# EAGLE design AH3761 (EAGLE 9.0.1)
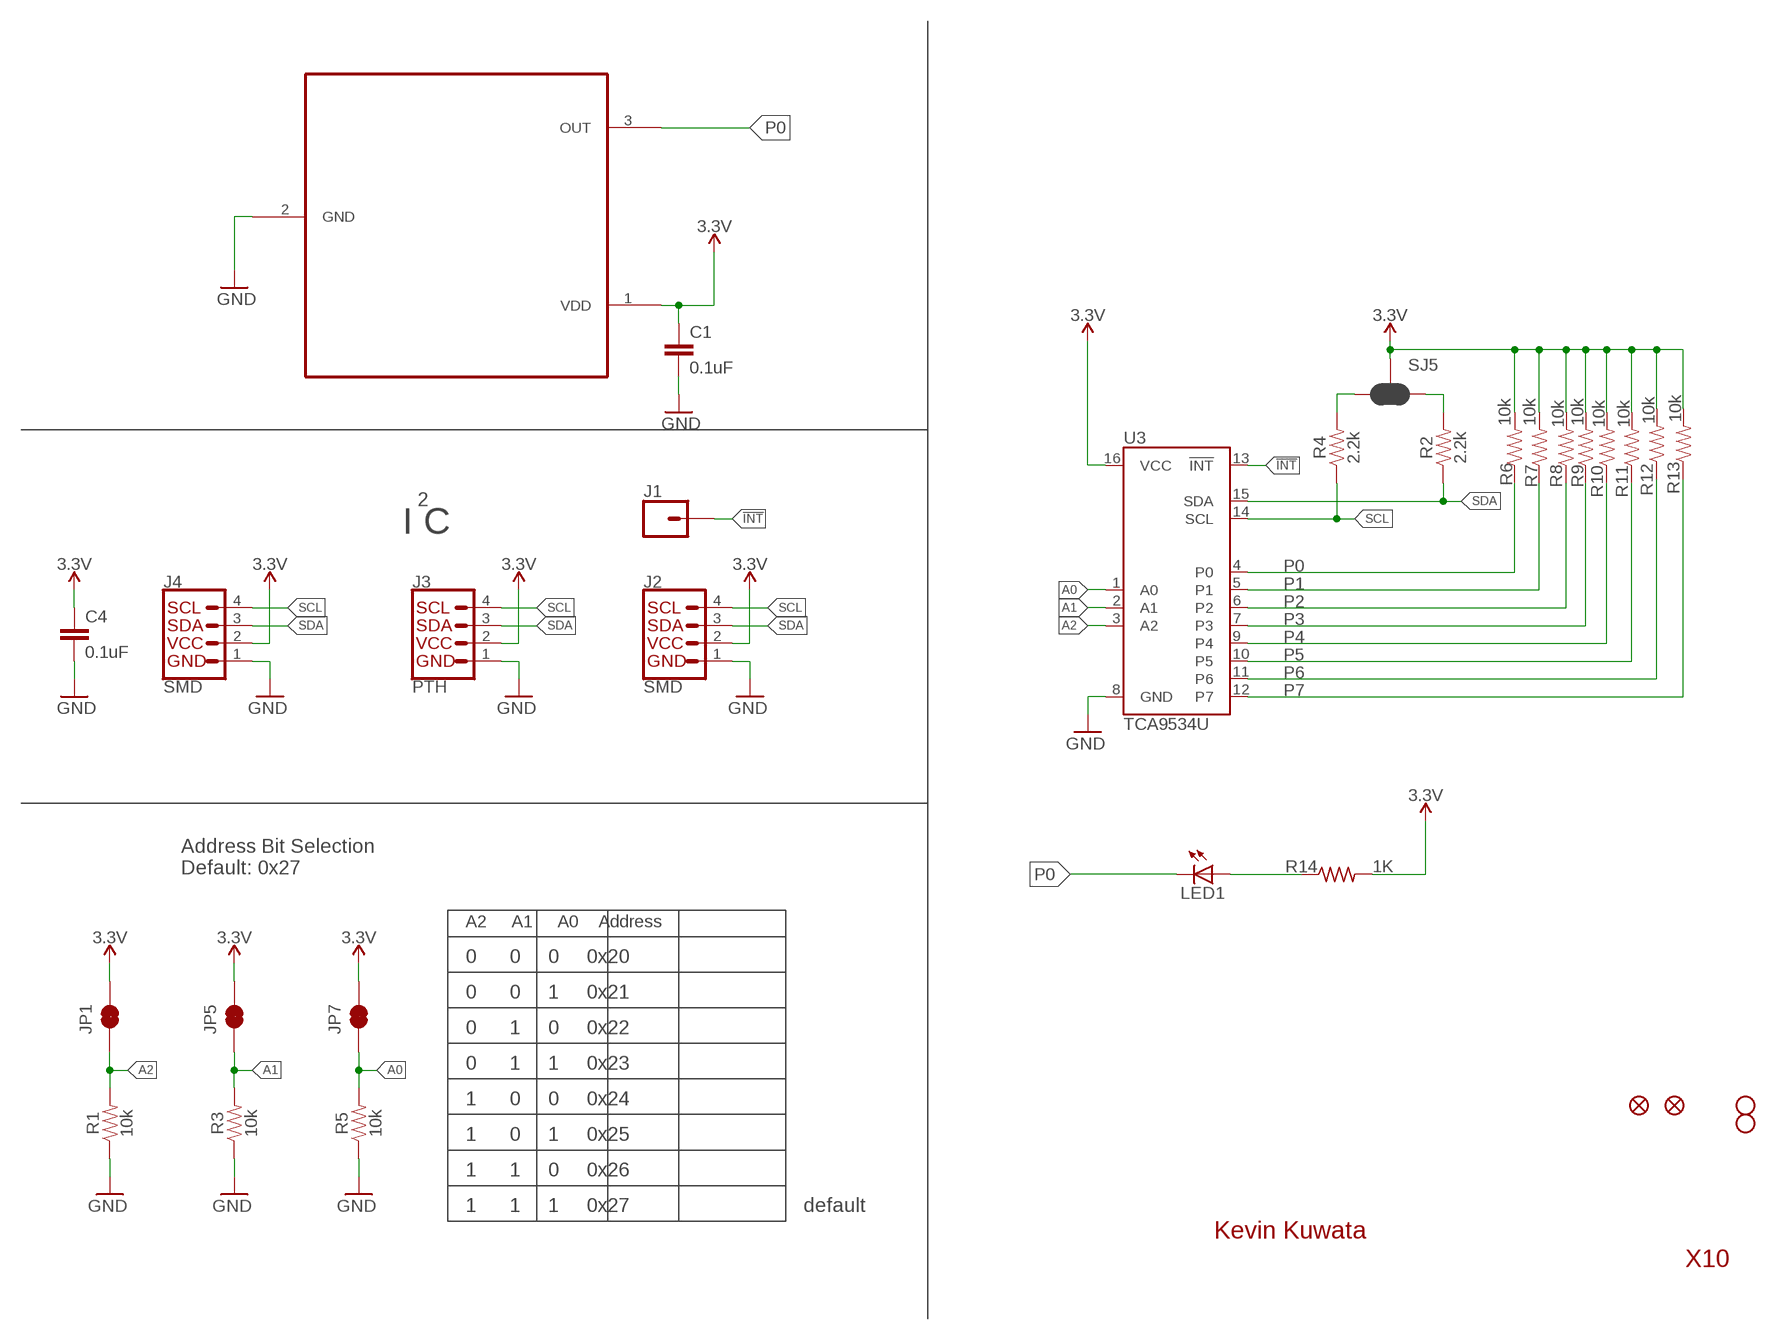
[diagram p0: schematic, sheet 1]

## Parts
C1  0.1uF  0.1UF-0603-25V-(+80/-20%)  [0603]
C4  0.1uF  0.1UF-0603-25V-(+80/-20%)  [0603]
J1  CONN_01PTH_NO_SILK_YES_STOP  [1X01_NO_SILK]
J2  SMD  I2C_STANDARDJS-1MM  [1X04_1MM_RA]
J3  PTH  I2C_STANDARD_NO_SILK  [1X04_NO_SILK]
J4  SMD  I2C_STANDARDJS-1MM  [1X04_1MM_RA]
JP1  JUMPER-SMT_2_NC_TRACE_NO-SILK  [SMT-JUMPER_2_NC_TRACE_NO-SILK]
JP2  FIDUCIALUFIDUCIAL  [MICRO-FIDUCIAL]
JP3  STAND-OFF  [STAND-OFF]
JP4  STAND-OFF  [STAND-OFF]
JP5  JUMPER-SMT_2_NC_TRACE_NO-SILK  [SMT-JUMPER_2_NC_TRACE_NO-SILK]
JP6  FIDUCIALUFIDUCIAL  [MICRO-FIDUCIAL]
JP7  JUMPER-SMT_2_NC_TRACE_NO-SILK  [SMT-JUMPER_2_NC_TRACE_NO-SILK]
LED1  LEDCHIPLED_0603  [CHIPLED_0603]
R1  10k  2.2KOHM-0603-1/10W-1%  [0603]
R2  2.2k  2.2KOHM-0603-1/10W-1%  [0603]
R3  10k  2.2KOHM-0603-1/10W-1%  [0603]
R4  2.2k  2.2KOHM-0603-1/10W-1%  [0603]
R5  10k  2.2KOHM-0603-1/10W-1%  [0603]
R6  10k  10KOHM-0603-1/10W-1%  [0603]
R7  10k  10KOHM-0603-1/10W-1%  [0603]
R8  10k  10KOHM-0603-1/10W-1%  [0603]
R9  10k  10KOHM-0603-1/10W-1%  [0603]
R10  10k  10KOHM-0603-1/10W-1%  [0603]
R11  10k  10KOHM-0603-1/10W-1%  [0603]
R12  10k  10KOHM-0603-1/10W-1%  [0603]
R13  10k  10KOHM-0603-1/10W-1%  [0603]
R14  1K  R-US_R0603  [R0603]
SJ5  SMT-JUMPER-_3-2-NC-PASTE_TALL  [SMT-JUMPER_3-2-NC-PASTE_SILK_TALLER_A]
U3  TCA9534U  [16SOIC]
U$1  AH3761  [SC-59]

## Nets
3.3V: C1.1 C4.1 J2.2(VCC) J3.2(VCC) J4.2(VCC) JP1.2 JP5.2 JP7.2 R6.2 R7.2 R8.2 R9.2 R10.2 R11.2 R12.2 R13.2 R14.2 SJ5.2 U3.16(VCC) U$1.1(VDD)
!INT: J1.1 U3.13(!INT)
A0: JP7.1 R5.2 U3.1(A0)
A1: JP5.1 R3.2 U3.2(A1)
A2: JP1.1 R1.2 U3.3(A2)
GND: C1.2 C4.2 J2.1(GND) J3.1(GND) J4.1(GND) R1.1 R3.1 R5.1 U3.8(GND) U$1.2(GND)
N$1: LED1.A R14.1
P0: LED1.C R6.1 U3.4(P0) U$1.3(OUT)
P1: R7.1 U3.5(P1)
P2: R8.1 U3.6(P2)
P3: R9.1 U3.7(P3)
P4: R10.1 U3.9(P4)
P5: R11.1 U3.10(P5)
P6: R12.1 U3.11(P6)
P7: R13.1 U3.12(P7)
SCL: J2.4(SCL) J3.4(SCL) J4.4(SCL) R4.1 U3.14(SCL)
SCL_PU1: R2.2 SJ5.1
SDA: J2.3(SDA) J3.3(SDA) J4.3(SDA) R2.1 U3.15(SDA)
SDA_PU1: R4.2 SJ5.3

## Notes on the sheet
- 2
- I C
- Address Bit Selection
  Default: 0x27
- A2     A1     A0    Address
- 0      0     0     0x20
- 0      0     1     0x21
- 0      1     0     0x22
- 0      1     1     0x23
- 1      0     0     0x24
- 1      0     1     0x25
- 1      1     0     0x26
- 1      1     1     0x27 | default
- Kevin Kuwata
- X10

## Library data of the parts
C1 C4 = SparkFun-Capacitors:0.1UF: 0.1µF ceramic capacitors A capacitor is a passive two-terminal electrical component used to store electrical energy temporarily in an electric field.; PROD_ID: CAP-00810
J1 = SparkFun-Connectors:CONN_01: Single connection point. Often used as Generic Header-pin footprint for 0.1 inch spaced/style header connections On any of the 0.1 inch spaced packages, you can populate with these: Break Away Headers - Straight <https://www.sparkfun.com/products/116> (PRT-00116) Break Away Male Headers - Right Angle <https://www.sparkfun.com/products/553> (PRT-00553) Female Headers <https://www.sparkfun.com/products/115> (PRT-00115) Break Away Headers - Machine Pin <https://www.sparkfun.com/products/117> (PRT-00117) Break Away Female Headers - Swiss Machine Pin <https://www.sparkfun.com/products/743> (PRT-00743) This device is also useful as a general connection point to wire up your design to another part of your project. Our various solder wires solder well into these plated through hole pads. Hook-Up Wire - Assortment (Stranded, 22 AWG) <https://www.sparkfun.com/products/11375> (PRT-11375) Hook-Up Wire - Assortment (Solid Core, 22 AWG) <https://www.sparkfun.com/products/11367> (PRT-11367) View the entire wire category on our website here <https://www.sparkfun.com/categories/141> Special notes: SMTSO-256-ET is a "flush mount" nut for a 4-40 screw. We mostly use this on specialty testbeds; it is a nice way to connect hardware to your PCB at an adjustable hieght. Also note, the SNAP packages are for using a snappable style connector. We sell a baggie of snaps and they are also used on two LilyPad designs: Snap Assortment - 30 pack (male and female) <https://www.sparkfun.com/products/11347> (DEV-11347) LilyPad Arduino SimpleSnap <https://www.sparkfun.com/products/10941> (DEV-10941) LilyPad SimpleSnap Protoboard <https://www.sparkfun.com/products/10940> (DEV-10940)
J2-J4 = SparkX:I2C_STANDARD: SparkFun I2C Standard Pinout Header SparkFun has standardized on a pinout for all I2C based sensor breakouts. This pinout allows I2C boards to be plugged directly into the headers on Arduino Uno compatible boards, and to be daisy chained easily. Example SparkFun Products: SparkFun Atmospheric Sensor Breakout - BME280 <https://www.sparkfun.com/products/13676> SparkFun Altitude/Pressure Sensor Breakout - MPL3115A2 <https://www.sparkfun.com/products/11084> SparkFun TOF Range Finder Sensor - VL6180 <https://www.sparkfun.com/products/12785>
JP1 JP5 JP7 = SparkFun-Jumpers:JUMPER-SMT_2_NC_TRACE: Normally closed trace jumper This jumper has a trace between two pads so it's normally closed (NC). Use a razor knife to open the connection. For best results follow the IPC guidelines for cutting traces: Cutout at least 0.063 mm (0.005 in). Remove all loose material to clean up the cut area. Seal the cut with an approved epoxy. Reapply solder to reclose the connection.
JP2 JP6 = SparkFun:FIDUCIAL: Fiducial Alignment Points Various fiducial points for machine vision alignment.
JP3 JP4 = SparkFun:STAND-OFF: Stand Off This is the mechanical footprint for a #4 phillips button head screw. Use the keepout ring to avoid running the screw head into surrounding components. SKU : PRT-00447
LED1 = adafruit:LED: LED OSRAM: - CHIPLED LG R971, LG N971, LY N971, LG Q971, LY Q971, LO R971, LY R971 LH N974, LH R974 LS Q976, LO Q976, LY Q976 LO Q996 - Hyper CHIPLED LW Q18S LB Q993, LB Q99A, LB R99A - SideLED LS A670, LO A670, LY A670, LG A670, LP A670 LB A673, LV A673, LT A673, LW A673 LH A674 LY A675 LS A676, LA A676, LO A676, LY A676, LW A676 LS A679, LY A679, LG A679 - Hyper Micro SIDELED® LS Y876, LA Y876, LO Y876, LY Y876 LT Y87S - SmartLED LW L88C, LW L88S LB L89C, LB L89S, LG L890 LS L89K, LO L89K, LY L89K LS L896, LA L896, LO L896, LY L896 - TOPLED LS T670, LO T670, LY T670, LG T670, LP T670 LSG T670, LSP T670, LSY T670, LOP T670, LYG T670 LG T671, LOG T671, LSG T671 LB T673, LV T673, LT T673, LW T673 LH T674 LS T676, LA T676, LO T676, LY T676, LB T676, LH T676, LSB T676, LW T676 LB T67C, LV T67C, LT T67C, LS T67K, LO T67K, LY T67K, LW E67C LS E67B, LA E67B, LO E67B, LY E67B, LB E67C, LV E67C, LT E67C LW T67C LS T679, LY T679, LG T679 LS T770, LO T770, LY T770, LG T770, LP T770 LB T773, LV T773, LT T773, LW T773 LH T774 LS E675, LA E675, LY E675, LS T675 LS T776, LA T776, LO T776, LY T776, LB T776 LHGB T686 LT T68C, LB T68C - Hyper Mini TOPLED® LB M676 - Mini TOPLED Santana® LG M470 LS M47K, LO M47K, LY M47K Source: http://www.osram.convergy.de/
R1 R3 R5 = SparkFun-Resistors:2.2KOHM: 2.2kΩ resistor A resistor is a passive two-terminal electrical component that implements electrical resistance as a circuit element. Resistors act to reduce current flow, and, at the same time, act to lower voltage levels within circuits. - Wikipedia; PROD_ID: RES-08272; VALUE: 2.2k
R2 R4 = SparkFun-Resistors:2.2KOHM: 2.2kΩ resistor A resistor is a passive two-terminal electrical component that implements electrical resistance as a circuit element. Resistors act to reduce current flow, and, at the same time, act to lower voltage levels within circuits. - Wikipedia; PROD_ID: RES-08272
R6-R13 = SparkFun-Resistors:10KOHM: 10kΩ resistor A resistor is a passive two-terminal electrical component that implements electrical resistance as a circuit element. Resistors act to reduce current flow, and, at the same time, act to lower voltage levels within circuits. - Wikipedia; PROD_ID: RES-00824
R14 = adafruit:R-US_: RESISTOR, American symbol
SJ5 = KevinKuwata_eagle:SMT-JUMPER-_3-2-NC-PASTE
U3 = KevinKuwata_eagle:TCA9534
U$1 = AH3761:AH3761

## Board
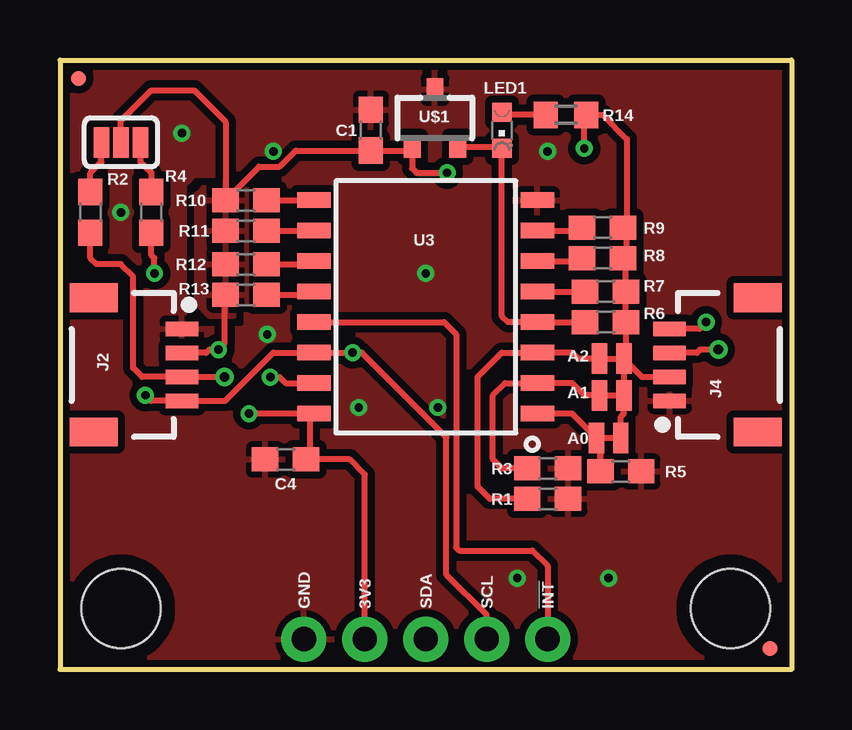
[diagram p1: board, top side]
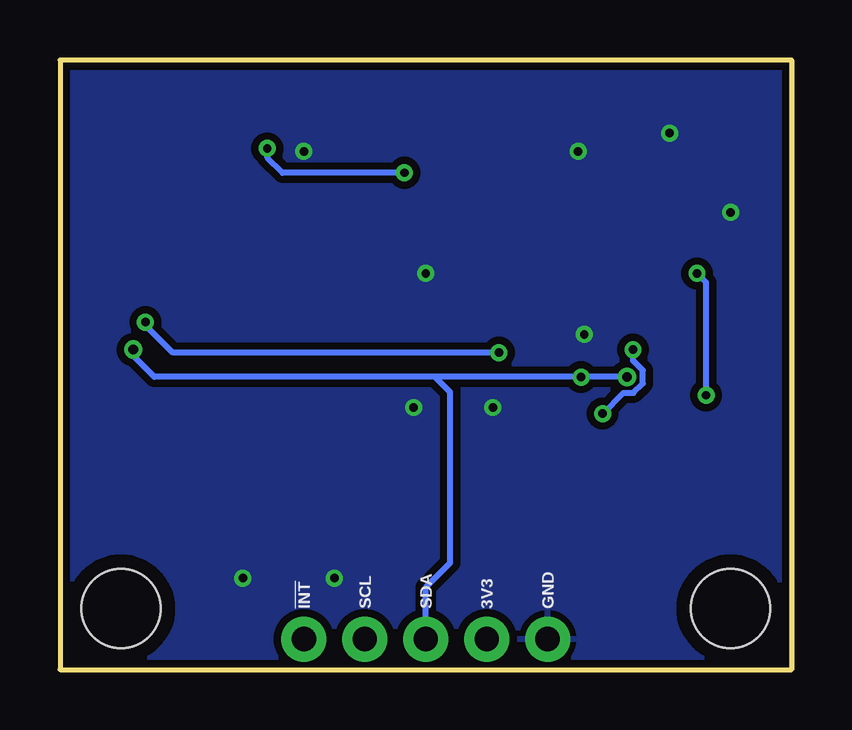
[diagram p2: board, bottom side, seen from below]

Size 30.48 x 25.4 mm. Coordinates in mm from the lower left corner, seen from the top.
Outline: 0,25.4 30.48,25.4 30.48,0 0,0 0,25.4
Copper layers (1*16): Top 0.035mm / dielectric 1.5mm / Bottom 0.035mm
Design rules "SparkFun-2-layer-PCBWay-LIMIT": minimum track width 6mil, minimum drill 12mil, track to track 6mil, track to pad 6mil, pad to pad 6mil, via to via 6mil, smd to smd 6mil, copper to edge 6mil, drill to drill 6mil, minimum pad ring 7mil, minimum via ring 7mil, stop-mask expansion 4mil, vias tented up to drill 25mil, thermal gap 10mil

### Footprints (pad centres in the part's own frame; a part is rotated, then mirrored left to right if it is on the bottom)
0603 = smd 1.1 x 1: 1 -0.85,0; 2 0.85,0
1X01_NO_SILK = drill 1.016 pad 1.88: 1 0,0
1X04_1MM_RA = smd 0.6 x 1.35: 1 -1.5,0; 2 -0.5,0; 3 0.5,0; 4 1.5,0 | smd 1.2 x 2: NC1 2.8,-3.675; NC2 -2.8,-3.675
1X04_NO_SILK = drill 1.016 pad 1.88: 1 0,0; 2 2.54,0; 3 5.08,0; 4 7.62,0
SMT-JUMPER_2_NC_TRACE_NO-SILK = smd 0.635 x 1.27: 1 -0.508,0; 2 0.508,0
MICRO-FIDUCIAL = smd 0.635 x 0.635: 1 0,0
STAND-OFF = hole 3.302: 0,0
CHIPLED_0603 = smd 0.8 x 0.8: A 0,-0.75; C 0,0.75
R0603 = smd 1 x 1.1: 1 -0.85,0; 2 0.85,0
SMT-JUMPER_3-2-NC-PASTE_SILK_TALLER_A = smd 0.635 x 1.27: 1 -0.813,0; 2 0,0; 3 0.813,0
16SOIC = smd 1.397 x 0.648: 1 -4.65,4.445; 2 -4.65,3.175; 3 -4.65,1.905; 4 -4.65,0.635; 5 -4.65,-0.635; 6 -4.65,-1.905; 7 -4.65,-3.175; 8 -4.65,-4.445; 9 4.65,-4.445; 10 4.65,-3.175; 11 4.65,-1.905; 12 4.65,-0.635; 13 4.65,0.635; 14 4.65,1.905; 15 4.65,3.175; 16 4.65,4.445
SC-59 = smd 0.7 x 0.9: 1 -0.95,-1.2; 2 0,1.2; 3 0.95,-1.2

### Placement (x,y rotation side)
C1  12.95,22.48 90 top
C4  9.4,8.76 180 top
J1  20.32,1.27 0 top
J2  5.08,12.7 270 top
J3  10.16,1.27 0 top
J4  25.4,12.7 90 top
JP1  22.99,12.95 0 top
JP2  29.59,0.89 0 top
JP3  2.54,2.54 0 top
JP4  27.94,2.54 0 top
JP5  22.99,11.43 0 top
JP6  0.76,24.64 0 top
JP7  22.86,9.65 0 top
LED1  18.41,22.48 180 top
R1  20.32,7.11 180 top
R2  1.27,19.05 90 top
R3  20.32,8.38 180 top
R4  3.81,19.05 90 top
R5  23.37,8.26 180 top
R6  22.73,14.48 0 top
R7  22.73,15.75 0 top
R8  22.61,17.14 0 top
R9  22.61,18.41 0 top
R10  7.75,19.56 180 top
R11  7.75,18.29 180 top
R12  7.75,16.89 180 top
R13  7.75,15.62 180 top
R14  21.08,23.11 0 top
SJ5  2.54,21.97 0 top
U3  15.24,15.11 180 top
U$1  15.62,22.99 0 top

### Tracks (layer width: path | path; a pad name or v marks a point on that pad's centre or on a via)
3.3V  (via drill 0.35)
  Top 0.254: JP7.2 23.37,10.54 23.5,10.67 JP5.2 23.5,12.55 | J3.2 12.7,8.13 12.06,8.76 10.41,8.76 | 10.41,8.76 C4.1 | 10.41,8.76 10.41,10.49 U3.16 v7.87,10.67 | J2.2 6.09,13.2 6.22,13.34 v6.6,13.34 6.86,13.59 6.86,15.58 R13.2 | SJ5.2 2.54,22.86 3.81,24.13 5.59,24.13 6.9,22.82 R10.2 8.3,20.96 9.15,20.96 9.82,21.63 C1.1 14.51,21.63 U$1.1 14.67,20.89 14.86,20.7 v16.13,20.7 | 22.1,22.95 21.95,23.09 | 21.95,23.09 R14.2 22.61,23.11 23.62,22.1 23.62,18.58 | 23.62,18.58 R9.2 | 23.62,18.58 23.62,17.31 R8.2 23.58,17.02 R7.2 R6.2 23.58,13.04 | v21.84,21.72 21.84,22.99 21.95,23.09 | 23.58,13.04 23.58,12.64 23.5,12.55 | JP1.2 23.5,12.55 | JP1.2 23.58,13.04 | JP1.2 24.25,12.2 J4.2
  Bottom 0.254: v7.87,10.67 7.01,11.53 6.58,11.53 6.2,11.92 6.2,12.47 6.6,12.87 v6.6,13.34 | v16.13,20.7 21.21,20.7 21.84,21.34 v21.84,21.72
  pour Top: 6.1,20.19 6.22,20.32 7.49,20.32 7.75,20.07 7.75,17.14 7.75,15.24 7.24,14.73 6.22,14.73 5.71,15.24 5.71,19.68 5.71,19.81
!INT
  Top 0.254: U3.13 16,14.48 16.51,13.97 16.51,5.08 16.64,4.95 19.68,4.95 20.32,4.32 J1.1
A0
  Top 0.254: U3.1 21.34,10.67 JP7.1 22.52,9.49 R5.2 22.52,8.98
A1
  Top 0.254: JP5.1 21.84,11.43 21.34,11.94 U3.2 18.54,11.94 18.03,11.43 18.03,8.76 18.41,8.38 R3.2
A2
  Top 0.254: JP1.1 21.59,12.95 21.34,13.21 U3.3 18.41,13.21 17.4,12.19 17.4,7.62 17.91,7.11 R1.2
GND  (via drill 0.35)
  other vias: 8.64,13.97 8.89,21.59 2.54,19.05 5.08,22.35 22.86,3.81 19.05,3.81 15.75,10.92 12.45,10.92 15.24,16.51 20.32,21.59
  pour Bottom (isolate 0.305): 0,0 0,25.4 30.48,25.4 30.48,0
  pour Top (isolate 0.305, rank 6): 0,0 0,25.4 30.48,25.4 30.48,0
N$1
  Top 0.254: R14.1 18.53,23.11 LED1.A
P0
  Top 0.254: R6.1 U3.4 18.67,14.48 18.41,14.73 LED1.C 18.36,21.79 U$1.3
P1
  Top 0.254: U3.5 R7.1
P2
  Top 0.254: U3.6 21.63,17.02 R8.1
P3
  Top 0.254: U3.7 21.63,18.29 R9.1
P4
  Top 0.254: R10.1 U3.9
P5
  Top 0.254: R11.1 U3.10
P6
  Top 0.254: R12.1 10.46,16.89 U3.11
P7
  Top 0.254: R13.1 10.46,15.62 U3.12
SCL  (via drill 0.35)
  Top 0.254: v26.92,14.48 26.65,14.2 J4.4 | v3.94,16.51 3.94,17.14 3.81,17.27 R4.1 | v3.56,11.43 3.79,11.2 J2.4 6.88,11.2 8.89,13.21 U3.14 v12.19,13.21 12.57,13.21 15.12,10.66 15.49,10.29 16.1,9.68 16.1,3.96 17.78,2.29 J3.4
  Bottom 0.254: v26.92,14.48 26.92,14.35 25.78,13.21 v12.19,13.21 | v3.56,11.43 3.56,16.13 v3.94,16.51
SCL_PU1
  Top 0.254: R2.2 1.27,20.7 1.73,21.16 SJ5.1
SDA  (via drill 0.35, 0.41)
  Top 0.254: v6.86,12.19 6.73,12.19 6.72,12.2 J2.3 3.42,12.2 3.05,12.57 3.05,16.38 2.54,16.89 1.52,16.89 1.27,17.14 R2.1 | v8.77,12.19 9.15,12.19 9.4,11.94 U3.15 | v27.43,13.34 26.67,13.34 26.54,13.2 J4.3
  Bottom 0.254: v8.77,12.19 v8.76,12.19 v6.86,12.19 14.86,12.19 | 14.86,12.19 26.54,12.19 27.43,13.08 v27.43,13.34 | J3.3 15.24,3.43 14.22,4.45 14.22,11.56 14.86,12.19
SDA_PU1
  Top 0.254: SJ5.3 3.35,21.16 3.81,20.7 R4.2

### Text on the board
tPlace: A2 | A1 | A0 | GND | 3V3 | SDA | SCL | !INT
bPlace: GND | 3V3 | SDA | SCL | !INT